# Altium schematic sheet Sensor_LoRa_Moist.SchDoc: Title
size 420 x 297 mm; Author: G.Kasprowicz; CompanyName: WUT ISE; DrawnBy: G.Kasprowicz; Organization: WUT ISE; Address1: PW ISE; Address2: Nowowiejska 15/19 00-665 Warsaw; Address3: gkasprow@gmail.com; Revision: 1.0; SheetNumber: -; SheetTotal: -; ModifiedBy: -; CheckedDate: -; Title2: Title2; DivGrp: WUT ISE; Designer: G.Kasprowicz; ModifiedDate: -; ProjectName: Sensor Box
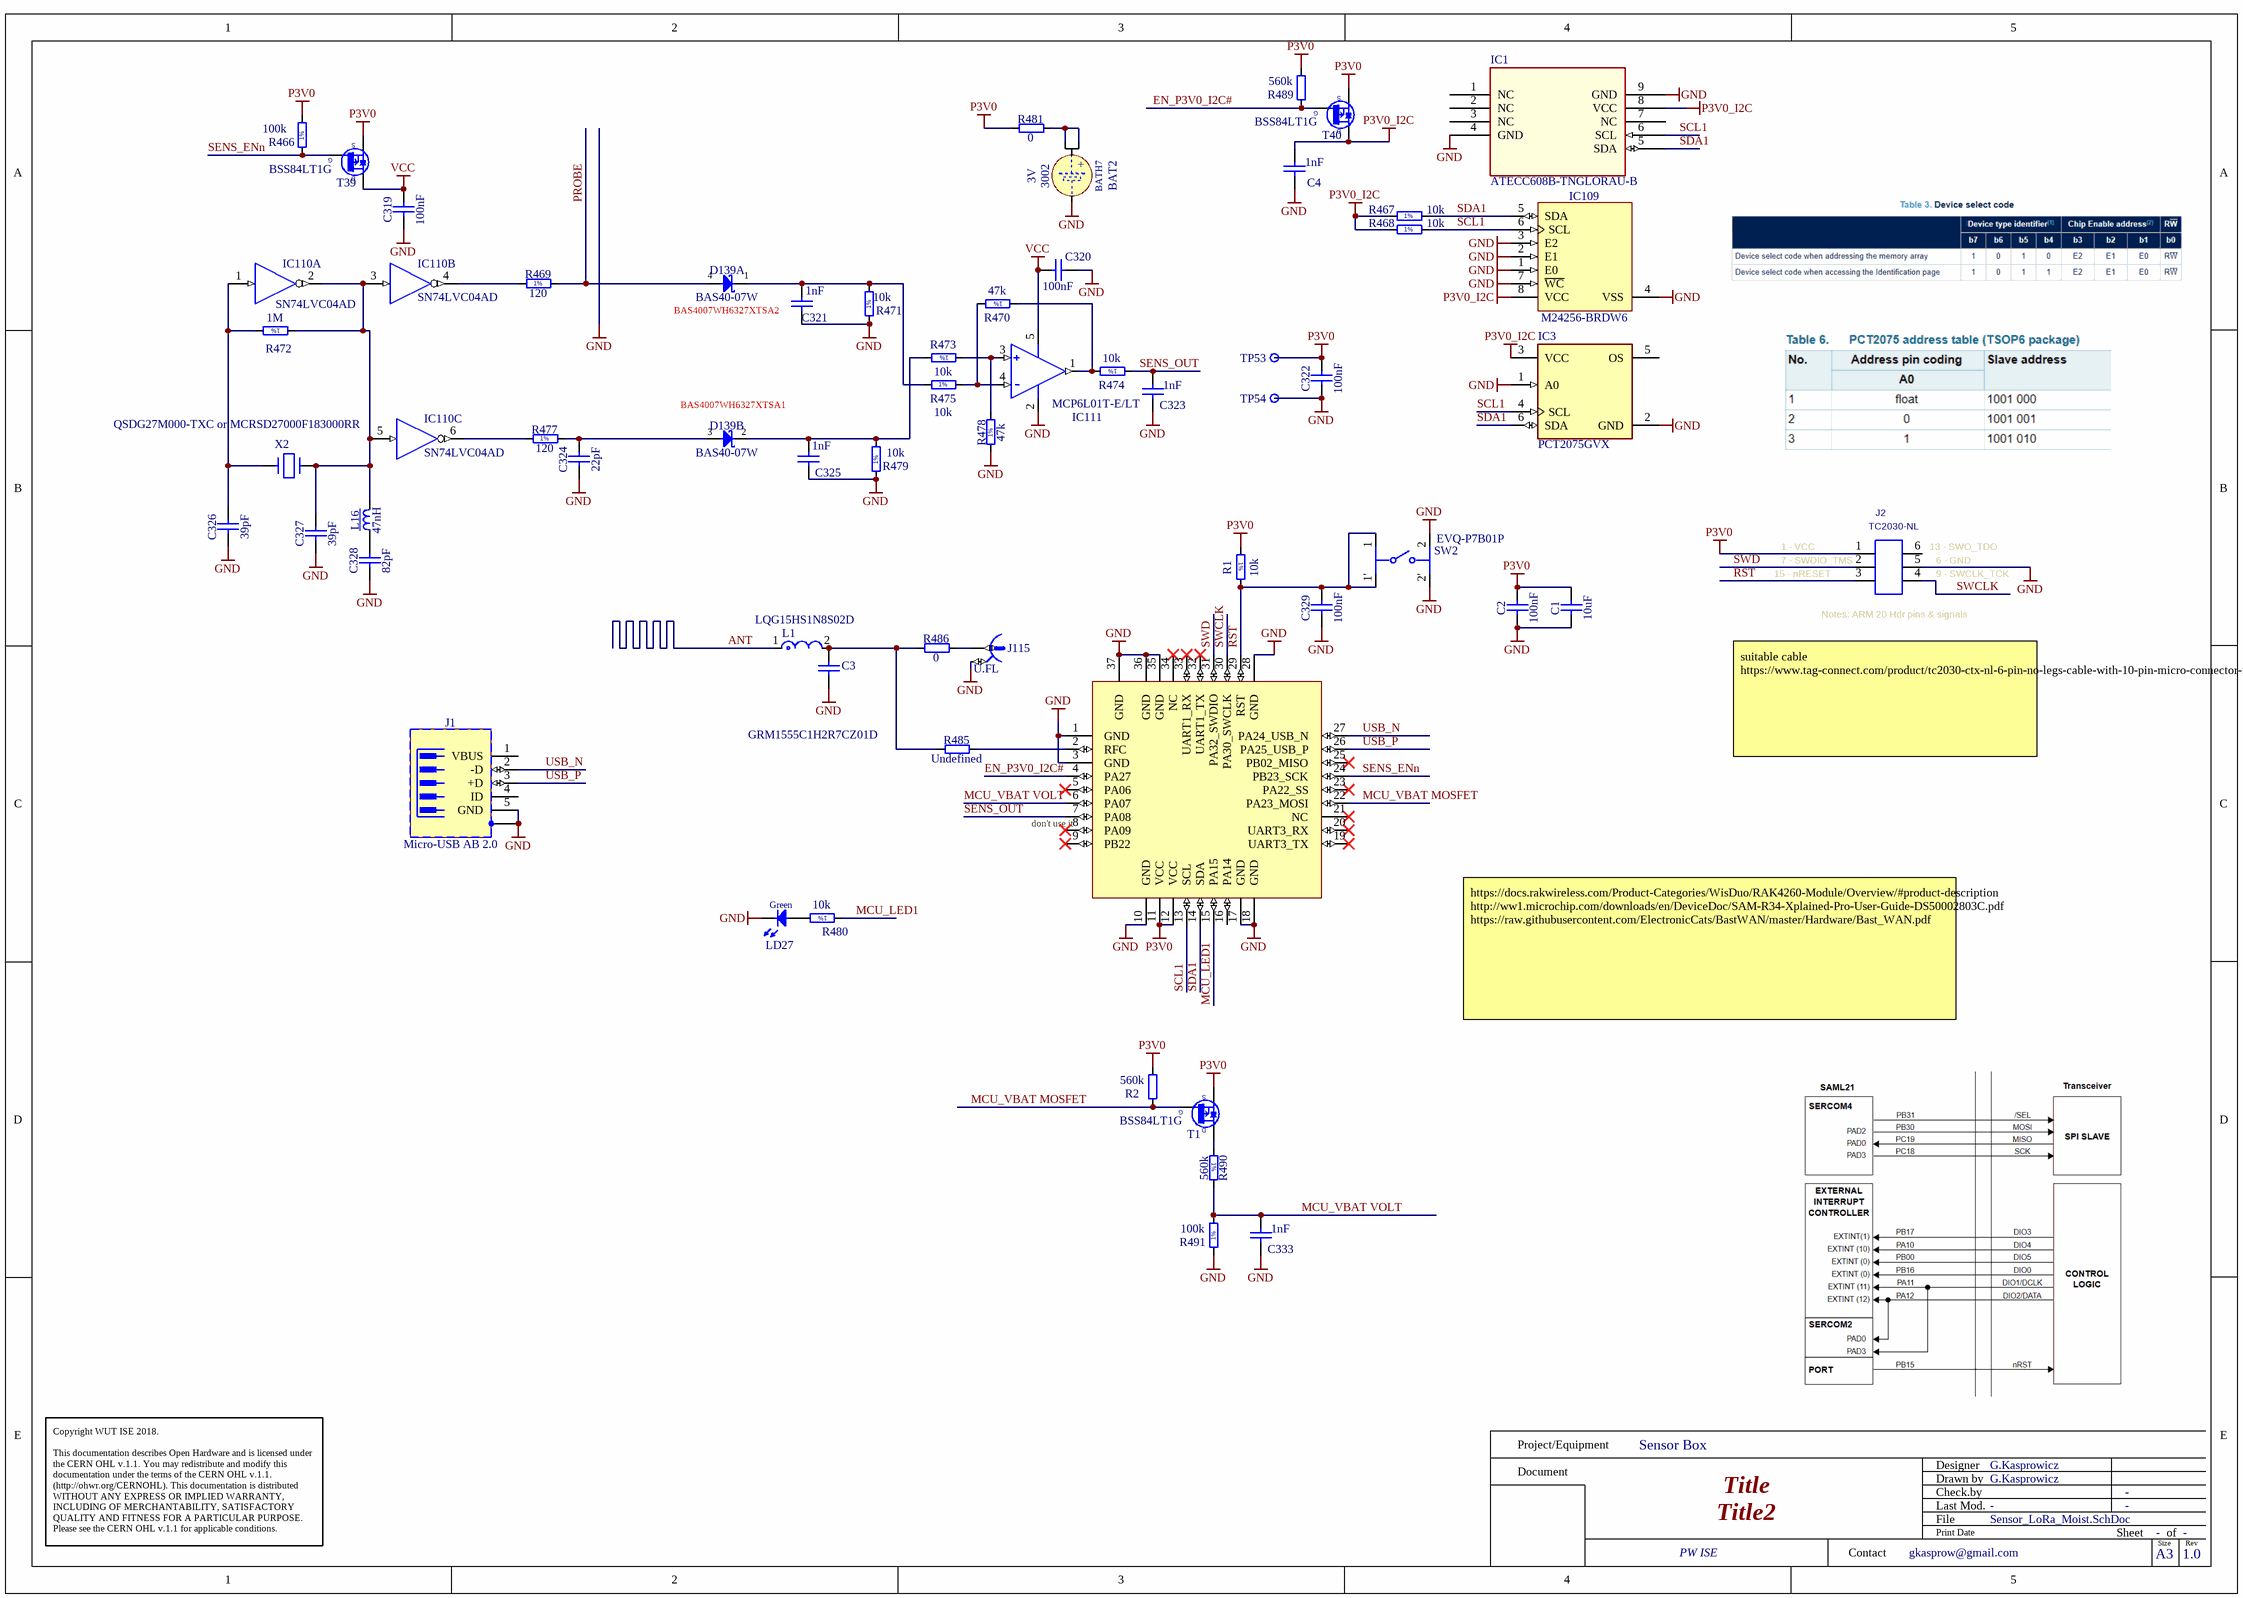
[diagram p0: Sensor_LoRa_Moist.SchDoc]

## Parts
BAT2  3V  [BAT_VARTA_CR2032]
BATH7  3002  [KEYSTONE 3002]
C1  10uF  [CAPC2012X135N]
C2  100nF  [CAPC1005X55N]
C3  GRM1555C1H2R7CZ01D  [CAPC1005X55X25ML05T10]
C4  1nF  [CAPC1005X55N]
C319  100nF  [CAPC1005X55N]
C320  100nF  [CAPC1005X55N]
C321  1nF  [CAPC1005X55N]
C322  100nF  [CAPC1005X55N]
C323  1nF  [CAPC1005X55N]
C324  22pF  [CAPC1005X55N]
C325  1nF  [CAPC1005X55N]
C326  39pF  [CAPC1608X87N]
C327  39pF  [CAPC1608X87N]
C328  82pF  [CAPC2012X90N]
C329  100nF  [CAPC1005X55N]
C333  1nF  [CAPC1005X55N]
D139  BAS40-07W  [INFINEON-PG-SOT343-4]  (parts A,B of 2)
IC1  ATECC608B-TNGLORAU-B  [UDFN8_MUY/Q4B_MCH-L]
IC2  RAK4260 - EU868  [RAK4260]  (value not drawn)
IC3  PCT2075GVX  [FP-SOT1353-1-MFG]
IC109  M24256-BRDW6  [SOP65P640X120-8N]
IC110  SN74LVC04AD  [SOIC127P600X175-14N]  (parts A,B,C of 6)
IC111  MCP6L01T-E/LT  [SC70]
J1  Micro-USB AB 2.0  [HIROSE_ZX62RD-AB-5P8]
J2  TC2030-NL  [TC2030-IDC]  (no BOM)
J115  U.FL  [HIROSE_U.FL-R-SMT-1(10)]
L1  LQG15HS1N8S02D  [FP-LQG15HH_02-IPC_C]
L16  47nH  [IND_COILCRAFT_0805CS]
LD27  Green  [LED_KINGBRIGHT_KPH-1608CGCK]
R1  10k  [RESC1005X40N]
R2  560k  [RESC1005X40N]
R466  100k  [RESC1005X40N]
R467  10k  [RESC1005X40N]
R468  10k  [RESC1005X40N]
R469  120  [RESC1005X40N]
R470  47k  [RESC1005X40N]
R471  10k  [RESC1005X40N]
R472  1M  [RESC1005X40N]
R473  10k  [RESC1005X40N]
R474  10k  [RESC1005X40N]
R475  10k  [RESC1005X40N]
R477  120  [RESC1005X40N]
R478  47k  [RESC1005X40N]
R479  10k  [RESC1005X40N]
R480  10k  [RESC1005X40N]
R481  0  [RESC1608X55N]
R485  Undefined  [RESC1608X55N]
R486  0  [RESC1608X55N]
R489  560k  [RESC1005X40N]
R490  560k  [RESC1005X40N]
R491  100k  [RESC1005X40N]
SW2  EVQ-P7B01P  [FP-EVQ-P7B01P-MFG]
T1  BSS84LT1G  [SOT95P240X110-3N]
T39  BSS84LT1G  [SOT95P240X110-3N]
T40  BSS84LT1G  [SOT95P240X110-3N]
TP53  Test Point  [TPS127]  (value not drawn)
TP54  Test Point  [TPS127]  (value not drawn)
X2  QSDG27M000-TXC or MCRSD27000F183000RR  [HC-49SM]

## Nets
GND: BATH7.2(MINUS) C1.1 C2.1 C3.1 C4.1 C319.1 C320.2 C321.1 C322.1 C323.1 C324.1 C325.1 C326.1 C327.1 C328.1 C329.1 C333.1 IC1.4(GND) IC1.9(GND) IC2.1(GND) IC2.3(GND) IC2.10(GND) IC2.17(GND) IC2.18(GND) IC2.28(GND) IC2.35(GND) IC2.36(GND) IC2.37(GND) IC3.1(A0) IC3.2(GND) IC109.1(E0) IC109.2(E1) IC109.3(E2) IC109.4(VSS) IC109.7(~{WC}) IC110.7(GND) IC111.2(V-) J1.5(GND) J1.6(SH) J2.5 J115.2 LD27.1(C) R471.1 R478.1 R479.1 R491.1 SW2.2 SW2.2' TP54.1
P3V0: C1.2 C2.2 C322.2 IC2.11(VCC) IC2.12(VCC) J2.1 R1.1 R2.2 R466.2 R481.1 R489.2 T1.2(S) T39.2(S) T40.2(S) TP53.1
P3V0_I2C: C4.2 IC1.8(VCC) IC3.3(VCC) IC109.8(VCC) R467.1 R468.1 T40.3(D)
VCC: C319.2 C320.1 IC110.14(VCC) IC111.5(V+) T39.3(D)
ANT: L1.1
EN_P3V0_I2C#: IC2.4(PA27) R489.1 T40.1(G)
MCU_LED1: IC2.15(PA15) R480.1
MCU_VBAT MOSFET: IC2.22(PA23_MOSI) R2.1 T1.1(G)
MCU_VBAT VOLT: C333.2 IC2.6(PA07) R490.2 R491.2
PROBE: D139.4(A) R469.2
RST: C329.2 IC2.29(RST) J2.3 R1.2 SW2.1 SW2.1'
SCL1: IC1.6(SCL) IC2.13(SCL) IC3.4(SCL) IC109.6(SCL) R468.2
SDA1: IC1.5(SDA) IC2.14(SDA) IC3.6(SDA) IC109.5(SDA) R467.2
SENS_ENn: IC2.24(PB23_SCK) R466.1 T39.1(G)
SENS_OUT: C323.2 IC2.7(PA08) R474.1
SWCLK: IC2.30(PA30_SWCLK) J2.4
SWD: IC2.31(PA32_SWDIO) J2.2
USB_N: IC2.27(PA24_USB_N) J1.2(-D)
USB_P: IC2.26(PA25_USB_P) J1.3(+D)
NetBATH7_1a: BATH7.1a(PLUS) BATH7.1b(PLUS) R481.2
NetC3_2: C3.2 L1.2 R485.2 R486.2
NetC321_2: C321.2 D139.1(C) R471.2 R475.1
NetC324_2: C324.2 D139.3(C) R477.2
NetC325_2: C325.2 D139.2(A) R473.2 R479.2
NetC326_2: C326.2 IC110.1(A) R472.2 X2.1
NetC327_2: C327.2 IC110.2(~{O}) IC110.3(A) IC110.5(A) L16.2 R472.1 X2.2
NetC328_2: C328.2 L16.1
NetIC2_2: IC2.2(RFC) R485.1
NetIC110_4: IC110.4(~{O}) R469.1
NetIC110_6: IC110.6(~{O}) R477.1
NetIC111_1: IC111.1(OUT) R470.1 R474.2
NetIC111_3: IC111.3(IN+) R473.1 R478.2
NetIC111_4: IC111.4(in-) R470.2 R475.2
NetJ115_1: J115.1 R486.1
NetLD27_2: LD27.2(A) R480.2
NetR490_1: R490.1 T1.3(D)

Not connected (* = marked no-connect by the designer): IC1 1(NC) 2(NC) 3(NC) 7(NC); IC2 5(PA06)* 8(PA09)* 9(PB22)* 16(PA14) 19(UART3_TX)* 20(UART3_RX)* 21(NC)* 23(PA22_SS)* 25(PB02_MISO)* 32(UART1_TX)* 33(UART1_RX)* 34(NC)*; IC3 5(OS); J1 1(VBUS) 4(ID); J2 6

## Notes on the sheet
- (near D139) BAS4007WH6327XTSA2
- (near D139) BAS4007WH6327XTSA1
- suitable cable
  https://www.tag-connect.com/product/tc2030-ctx-nl-6-pin-no-legs-cable-with-10-pin-micro-connector-for-cortex-processors
- (near IC2) don't use it
- https://docs.rakwireless.com/Product-Categories/WisDuo/RAK4260-Module/Overview/#product-description
  http://ww1.microchip.com/downloads/en/DeviceDoc/SAM-R34-Xplained-Pro-User-Guide-DS50002803C.pdf
  https://raw.githubusercontent.com/ElectronicCats/BastWAN/master/Hardware/Bast_WAN.pdf
- Project/Equipment
- Document
- Designer
- Drawn by
- Check.by
- Copyright WUT ISE 2018.
  This documentation describes Open Hardware and is licensed under the CERN OHL v.1.1. You may redistribute and modify this documentation under the terms of the CERN OHL v.1.1. (http://ohwr.org/CERNOHL). This documentation is distributed WITHOUT ANY EXPRESS OR IMPLIED WARRANTY, INCLUDING OF MERCHANTABILITY, SATISFACTORY QUALITY AND FITNESS FOR A PARTICULAR PURPOSE. Please see the CERN OHL v.1.1 for applicable conditions.
- Contact
- File
- Last Mod.
- Print Date
- Sheet
- Size
- A3
- of
- Rev
- (in symbol BAT_VARTA_CR2032) +
- (in symbol BATTERY_HOLD_CR2032_SMD) +
- (in symbol HDR 6 TC2030-NL) 1 - VCC; 13 - SWO_TDO; 7 - SWDIO_TMS; 6 - GND; 15 - nRESET; 9 - SWCLK_TCK; Notes: ARM 20 Hdr pins & signals
- (in symbol R0402_1M_1%_0.0625W_100PPM) 1%
- (in symbol R0402_10K_1%_0.0625W_100PPM) 1%
- (in symbol R0402_47K_1%_0.0625W_100PPM) 1%
- (in symbol R0402_100K_1%_0.0625W_100PPM) 1%
- (in symbol R0402_120R_1%_0.0625W_100PPM) 1%
- (in symbol R0402_560K_1%_0.0625W_100PPM) 1%

## Library data of the parts
BAT2 = BAT_VARTA_CR2032: Battery for use only with Socket Holder; Part Description: 20x3.2mm Lithium Coin Cells Type CR2032; Manufacturer: VARTA; Manufacturer Part Number: 6032101501; PressFit: No; Power: 230mAh; Part Number: BAT_VARTA_CR2032; Component Kind: Standard; Component Type: Standard; Pin Count: 0; PackageDescription: CR2032, 20mm Diameter x 3.2mm  Height Lithium Coin Cells; Family: Battery; Mounted: Yes; Socket: Yes; SMD: No; Sense: No; Value: 3V; ComponentHeight: 3.2mm; HelpURL: \\cern.ch\dfs\Applications\Altium\Datasheets\BAT_VARTA_CR2032.pdf; Author: CERN DEM JLC; CreateDate: 20/10/2009; LatestRevisionDate: 20/10/2009
BATH7 = BATTERY_HOLD_CR2032_SMD: Battery Holder Keystone 3002; Part Number: BATH_KEYSTONE_3000; Part Description: KEYSTONE 3002 CR2032 BATTERY HOLDER; PressFit: No; Component Kind: Standard; Component Type: Standard; Pin Count: 3; PackageDescription: KEYSTONE 3002 CR2032 BATTERY HOLDER; Family: Battery; Mounted: Yes; Socket: No; SMD: Yes; Sense: No; Manufacturer: KEYSTONE; Manufacturer Part Number: 3002; ComponentHeight: 3.17mm; HelpURL: \\cern.ch\dfs\Applications\Altium\Datasheets\BATH_KEYSTONE_3000.pdf; Author: GK; CreateDate: 17/04/2012; LatestRevisionDate: 07/06/2017
C1 = CC0805_10UF_16V_10%_X5R: Non-polarised capacitor; Part Description: SMD Multilayer Chip Ceramic Capacitor; Manufacturer: GENERIC; Manufacturer1 Part Number: C0805C106K4PAC; Voltage: 16V; TC: X5R; Tolerance: ±10%; Part Number: CC0805_10UF_16V_10%_X5R; Component Kind: Standard; Component Type: Standard; Pin Count: 2; Value: 10uF; Status: Preferred; Manufacturer Part Number: CC0805_10UF_16V_10%_X5R; Case: 0805; Mounted: Yes; Socket: No; SMD: Yes; Sense: No; Manufacturer1 Example: KEMET; Manufacturer1 ComponentHeight: 1.4mm; HelpURL: \\cern.ch\dfs\Applications\Altium\Datasheets\CC1206_X5R_KEMET.pdf; Author: CERN DEM JLC; CreateDate: 03.12.2007; LatestRevisionDate: 03.12.2007
C2 C319 C320 C322 C329 = CC0402_100NF_16V_10%_X5R: Non-polarised capacitor; Part Description: SMD Multilayer Chip Ceramic Capacitor; Manufacturer: GENERIC; Manufacturer1 Part Number: GRM155R61C104KA88D; Voltage: 16V; TC: X5R; Tolerance: ±10%; Part Number: CC0402_100NF_16V_10%_X5R; Component Kind: Standard; Component Type: Standard; Pin Count: 2; Value: 100nF; Status: None; Manufacturer Part Number: CC0402_100NF_16V_10%_X5R; Case: 0402; Mounted: Yes; Socket: No; SMD: Yes; Sense: No; Manufacturer1 Example: MURATA; Manufacturer1 ComponentHeight: 0.55mm; HelpURL: \\cern.ch\dfs\Applications\Altium\Datasheets\CC0402_X5R_MURATA_GRM.pdf; Author: CERN DEM JLC; CreateDate: 10.12.2013; LatestRevisionDate: 10.12.2013
C3 = CMP-2008-04329-1: Manufacturer: Murata; Part Number: GRM1555C1H2R7CZ01D
C4 C321 C323 C325 C333 = CC0402_1NF_50V_10%_X7R: Non-polarised capacitor; Part Description: SMD Multilayer Chip Ceramic Capacitor; Manufacturer: GENERIC; Manufacturer1 Part Number: 223858715623; Voltage: 50V; TC: X7R; Tolerance: ±10%; Part Number: CC0402_1NF_50V_10%_X7R; Component Kind: Standard; Component Type: Standard; Pin Count: 2; Value: 1nF; Status: Not Recommended; Manufacturer Part Number: CC0402_1NF_50V_10%_X7R; Case: 0402; Mounted: Yes; Socket: No; SMD: Yes; Sense: No; Manufacturer1 Example: PHYCOMP; Manufacturer1 ComponentHeight: 0.55mm; HelpURL: \\cern.ch\dfs\Applications\Altium\Datasheets\CC0402_X7R_PHYCOMP.pdf; Author: CERN DEM JLC; CreateDate: 03/12/2007; LatestRevisionDate: 03/12/2007
C324 = CC0402_22PF_50V_5%_C0G: Non-polarised capacitor; Part Description: SMD Multilayer Chip Ceramic Capacitor; Manufacturer: GENERIC; Manufacturer1 Part Number: C0402C220J5GACTU; Voltage: 50V; TC: C0G/NP0; Tolerance: ±5%; Part Number: CC0402_22PF_50V_5%_C0G; Component Kind: Standard; Component Type: Standard; Pin Count: 2; Value: 22pF; Status: Preferred; Manufacturer Part Number: CC0402_22PF_50V_5%_C0G; Case: 0402; Mounted: Yes; Socket: No; SMD: Yes; Sense: No; Manufacturer1 Example: KEMET; Manufacturer1 ComponentHeight: 0.55mm; HelpURL: \\cern.ch\dfs\Applications\Altium\Datasheets\CC0805_C0G_KEMET_(Commercial Grade).pdf; Author: CERN DEM JLC; CreateDate: 03/12/2007; LatestRevisionDate: 03/12/2007
C326 C327 = CC0603_39PF_50V_5%_NP0: Non-polarised capacitor; Part Description: SMD Multilayer Chip Ceramic Capacitor; Manufacturer: GENERIC; Manufacturer1 Part Number: 223886715399; Voltage: 50V; TC: C0G/NP0; Tolerance: ±5%; Part Number: CC0603_39PF_50V_5%_NP0; Component Kind: Standard; Component Type: Standard; Pin Count: 2; Value: 39pF; Status: Preferred; Manufacturer Part Number: CC0603_39PF_50V_5%_NP0; Case: 0603; Mounted: Yes; Socket: No; SMD: Yes; Sense: No; Manufacturer1 Example: PHYCOMP; Manufacturer1 ComponentHeight: 0.87mm; HelpURL: \\cern.ch\dfs\Applications\Altium\Datasheets\CC0603_NP0_PHYCOMP.pdf; Author: CERN DEM JLC; CreateDate: 03/12/2007; LatestRevisionDate: 03/12/2007
C328 = CC0805_82PF_100V_1%_NP0_AVX_08051A820FAT2A: Non-polarised capacitor; Part Description: SMD Multilayer Chip Ceramic Capacitor; Manufacturer: AVX; Voltage: 100V; TC: NP0; Tolerance: ±1%; Part Number: CC0805_82PF_100V_1%_NP0_AVX_08051A820FAT2A; Component Kind: Standard; Component Type: Standard; Pin Count: 2; Value: 82pF; Status: Not Recommended; Manufacturer Part Number: 08051A820FAT2A; Case: 0805; Mounted: Yes; Socket: No; SMD: Yes; Sense: No; ComponentHeight: 0.9mm; HelpURL: \\cern.ch\dfs\Applications\Altium\Datasheets\CC0805_C0G_AVX.pdf; Author: CERN DEM WB; CreateDate: 26/07/2016; LatestRevisionDate: 26/07/2016
D139 = D_BAS40-07W: Anti-Parallel Pair Schottky Diode; Part Number: BAS4007WH6327XTSA1; Part Description: independent Pair Schottky Diode; Manufacturer: INFINEON; Voltage: 4V; Power: 120mA; PressFit: No; Bonding: No; Component Kind: Standard; Component Type: Standard; Device: BAS40-07W; PackageDescription: INFINEON PG-SOT343-4, SOT343, 1.30mm Pitch; 4 Pin,1.25mm W X 2.00mm L X 1.10mm H body, IPC Medium Density; Manufacturer Part Number: BAS4007WH6327XTSA1; Pin Count: 4; Case: SOT343; Mounted: Yes; Socket: No; SMD: Yes; Sense: No; ComponentHeight: 1.1mm; HelpURL: \\cern.ch\dfs\Applications\Altium\Datasheets\BAT15099E6327HTSA1.pdf; Author: GK; CreateDate: 28/03/2018; LatestRevisionDate: 28/03/2018
IC1 = CRYPTO_ATECC608B-TNGLORAU-B: Pre-provisioned secure element for LoRaWAN; Vendor: Microchip; Built_By: EMA_Cory; SourceLibrary: Add_to_database_2021-02-23; Datasheet: https://ww1.microchip.com/downloads/en/DeviceDoc/ATECC608B-TNGLoRaWAN-CryptoAuthentication-Data-Sheet-DS40002248A.pdf; Manufacturer_Part_Number: ATECC608B-TNGLORAU-B; Copyright: Copyright (C) 2018 Accelerated Designs. All rights reserved; RefDes: RefDes; Type: DEV
IC2 = RF_RAK4260: RAK4260 LoRaWAN module from RAKwireless.; Manufacturer Part Number: RAK4260 - EU868; Manufacturer: RAK WIreless; DeviceName: RAK4260 - EU868; Device: RAK4260 - EU868; Part Description: RAK4260 LoRaWAN module; Package: RAK4260
IC3 = CMP-10174-000001-1: SENSOR DIGITAL -55C-125C 6TSOP; Manufacturer: NXP Semiconductors; Max Supply Voltage: 5.5V; Min Supply Voltage: 2.7V; Sensor Output: I2C; Resolution: 11bits; Standoff Height: 0.013mm; Operating Supply Current: 125-200uA; Max Junction Temp: +150°C; Digikey Description: SENSOR DIGITAL -55C-125C 6TSOP; ComponentLink2Description: Datasheet; Ambient Temperature Range High: +125°C; Mouser Description: Board Mount Temperature Sensors Digital temp sensor and thermal watchdog; Ipc Land Pattern Name: SOT95P275X100-6; RoHS: TRUE; Interface: I2C; Device Class L3: unset; Footprint Url: https://www.nxp.com/docs/en/package-information/SOT1353-1.pdf; Device Class L1: Sensors; Manufacturer Part Number: PCT2075GVX; Temperature: -55°C to +125°C; Lead Free: Yes; ComponentLink2URL: https://www.nxp.com/docs/en/data-sheet/PCT2075.pdf; Height: 1.1mm; Device Class L2: Temperature and Humidity Sensors; Temperature Range High: +125°C; Package: SOT1353-1; Category: IC; Automotive: No; Ambient Temperature Range Low: -55°C; Temperature Range Low: -55°C; Octopart: https://octopart.com/pct2075gvx-nxp+semiconductors-50417606
IC109 = MEM_M24256-BRDW6P: 256-Kbit Serial I²C Bus EEPROM; Manufacturer: ST MICROELECTRONICS; PressFit: No; Bonding: No; Part Number: M24256-BRDW6P; Component Kind: Standard; Component Type: Standard; Device: M24256-BRDW6; PackageDescription: SOP, 0.65mm pitch; 8 pin, 4.40mm W X 3.00mm L X 1.20mm H body, IPC Medium Density; Part Description: 256-Kbit Serial I²C Bus EEPROM; Manufacturer Part Number: M24256-BRDW6; Pin Count: 8; Case: TSSOP8; Mounted: Yes; Socket: No; SMD: Yes; Sense: No; ComponentHeight: 1.2mm; HelpURL: \\cern.ch\dfs\Applications\Altium\Datasheets\M24256-BRDW6P.pdf; Author: CERN DEM MR; CreateDate: 17.03.2016; LatestRevisionDate: 17.03.2016
IC110 = SN74LVC04AD: Hex Inverter; Part Description: Hex Inverters; Manufacturer: TEXAS INSTRUMENTS; PressFit: No; Bonding: No; Part Number: SN74LVC04AD; Component Kind: Standard; Component Type: Standard; Device: SN74LVC04AD; PackageDescription: SOIC 14, Pitch 1.27mm - Body 4x8.75mm, IPC Medium Density; Manufacturer Part Number: SN74LVC04AD; Pin Count: 12; Case: SOIC14; Mounted: Yes; Socket: No; SMD: Yes; Sense: No; ComponentHeight: 1.75mm; Author: CERN DEM JLC; HelpURL: \\cern.ch\dfs\Applications\Altium\Datasheets\SN74LVC04AD.pdf; CreateDate: 21/06/2011; LatestRevisionDate: 21/06/2011
IC111 = OA_MCP6001_SC-70: 1 MHz, Low-Power Op Amp
J1 = HIROSE_ZX62RD-AB-5P8: 5 Pin + 1 Shield USB Receptacle; Part Description: Micro-USB 2.0 Right Angle, SMD Type AB - Reverse (Top mount), Shell Through Hole; Manufacturer: HIROSE (HRS); PressFit: No; Part Number: HIROSE_ZX62RD-AB-5P8; Component Kind: Standard; Component Type: Standard; Pin Count: 7; Family: Micro-USB AB 2.0; Mounted: Yes; Socket: No; SMD: Yes; Sense: No; Status: Obsolete; Manufacturer Part Number: ZX62RD-AB-5P8; ComponentHeight: 2.35mm; HelpURL: \\cern.ch\dfs\Applications\Altium\Datasheets\HIROSE_ZX62RD-AB-5P8.pdf; ComponentLink1URL: \\cern.ch\dfs\Applications\Altium\Datasheets\HIROSE_ZX62RD-AB-5P8_Package-Drawing.pdf; ComponentLink1Description: Package-Drawing; Author: CERN DEM JLC; CreateDate: 29.10.2014; LatestRevisionDate: 22.06.2017
J2 = HDR 6 TC2030-NL: HDR, TC2030, 6 Pin, Footprint only; Mfg-1: Tag-Connect; Mfg-1-P/N: TC2030-IDC-NL; Value: TC2030-NL
J115 = HIROSE_U.FL-R-SMT-1(10): Part Description: Up to 6GHz Ultra Small Surface Mount Male Coaxial Connectors U.FL Series; Manufacturer: HIROSE (HRS); PressFit: No; Part Number: HIROSE_U.FL-R-SMT-1(10); Component Kind: Standard; Component Type: Standard; Pin Count: 2; Family: U.FL; Mounted: Yes; Socket: No; SMD: Yes; Sense: No; Status: None; Manufacturer Part Number: U.FL-R-SMT-1(10); ComponentHeight: 1.25mm; HelpURL: \\cern.ch\dfs\Applications\Altium\Datasheets\HIROSE_U.FL-R-SMT-1(10).pdf; Author: CERN DEM JLC; CreateDate: 24/03/2010; LatestRevisionDate: 24/03/2010
L1 = CMP-06042-005877-1: Multilayer type RF Inductor 1.8nH ±0.3nH 0.08Ω 950mA 0402; Self Resonant Frequency: 6GHz; Core Material: Air; DC Current: 300mA; Q Factor: 8; Test Frequency: 100MHz; Shielding: Unshielded; DC Resistance (DCR): 100mR; Inductance: 1.8nH; Packaging: Tape and Reel; Lead Free: Lead Free; Min Operating Temperature: -55°C; Height - Seated (Max): 0.022inch; Case/Package: 0402; Mount: Surface Mount; Package Quantity: 1; Width: 0.02inch; Length: 0.039inch; Max Operating Temperature: 125°C; Depth: 0.55mm; Height: 0.5mm; Radiation Hardening: No; Max DC Current: 300mA; Case Code (Metric): 1005; Termination: SMD/SMT; Military Standard: Not; Current Rating: 300mA; Case Code (Imperial): 0402
L16 = IND_47NH_2%_COILCRAFT_0805CS: Inductor With Core; Part Description: SMT Chip Inductor; Manufacturer Part Number: 0805CS-470XGLC; Power: 500mA; Resistance: 0.31R; Tolerance: ±2%; Part Number: IND_47NH_2%_COILCRAFT_0805CS; Component Kind: Standard; Component Type: Standard; Pin Count: 2; Value: 47nH; Status: None; Manufacturer: COILCRAFT; Case: 0805; Mounted: Yes; Socket: No; SMD: Yes; Sense: No; ComponentHeight: 1.52mm; HelpURL: \\cern.ch\dfs\Applications\Altium\Datasheets\IND_COILCRAFT_0805CS.pdf; Author: CERN DEM JLC; CreateDate: 19/08/2013; LatestRevisionDate: 20/08/2013
LD27 = LED_KINGBRIGHT_KPH-1608CGCK: LED Green 1C 2A; Part Description: SMD Green LED, Case 1.6mmX0.8mm(0603), 0.65mm Thickness; PressFit: No; Bonding: No; Part Number: LED_KINGBRIGHT_KPH-1608CGCK; Component Kind: Standard; Component Type: Standard; Color: Green; PackageDescription: SMT Green LED, Case 0603, Body L 1.6 x W 0.8mm H 0.65mm; Manufacturer: KINGBRIGHT; Manufacturer Part Number: KPH-1608CGCK; Pin Count: 2; Mounted: Yes; Socket: No; SMD: Yes; Sense: No; ComponentHeight: 0.65mm; HelpURL: \\cern.ch\dfs\Applications\Altium\Datasheets\LED_KINGBRIGHT_KPH-1608CGCK.pdf; Author: CERN DEM JLC; CreateDate: 03.07.2017; LatestRevisionDate: 03.07.2017
R1 R467 R468 R471 R473-R475 R479 R480 = R0402_10K_1%_0.0625W_100PPM: Resistor - 1%; Part Description: General Purpose Thick Film Chip Resistor; Manufacturer: GENERIC; Manufacturer1 Part Number: 232270671003L; TC: ±100ppm/°C; PressFit: No; Part Number: R0402_10K_1%_0.0625W_100PPM; Component Kind: Standard; Component Type: Standard; Pin Count: 2; Value: 10k; Status: Not Recommended; Power: 0.0625W; Tolerance: ±1%; Manufacturer Part Number: R0402_10K_1%_0.0625W_100PPM; Case: 0402; Mounted: Yes; Sense: No; Socket: No; SMD: Yes; Manufacturer1 Example: YAGEO PHYCOMP; Manufacturer1 ComponentHeight: 0.4mm; HelpURL: \\cern.ch\dfs\Applications\Altium\Datasheets\R0402_Phycomp_RC0402.pdf; Author: CERN DEM JLC; CreateDate: 03.12.2007; LatestRevisionDate: 17.10.2012
R2 R489 R490 = R0402_560K_1%_0.0625W_100PPM: Resistor - 1%; Part Description: General Purpose Thick Film Chip Resistor; Manufacturer: GENERIC; Manufacturer1 Part Number: 232270675604L; TC: ±100ppm/°C; PressFit: No; Part Number: R0402_560K_1%_0.0625W_100PPM; Component Kind: Standard; Component Type: Standard; Pin Count: 2; Value: 560k; Status: Not Recommended; Power: 0.0625W; Tolerance: ±1%; Manufacturer Part Number: R0402_560K_1%_0.0625W_100PPM; Case: 0402; Mounted: Yes; Sense: No; Socket: No; SMD: Yes; Manufacturer1 Example: YAGEO PHYCOMP; Manufacturer1 ComponentHeight: 0.4mm; HelpURL: \\cern.ch\dfs\Applications\Altium\Datasheets\R0402_Phycomp_RC0402.pdf; Author: CERN DEM JLC
  R2 R489: CreateDate: 03.12.2007; LatestRevisionDate: 17.10.2012
  R490: CreateDate: 03/12/2007; LatestRevisionDate: 17/10/2012
R466 R491 = R0402_100K_1%_0.0625W_100PPM: Resistor - 1%; Part Description: General Purpose Thick Film Chip Resistor; Manufacturer: GENERIC; Manufacturer1 Part Number: 232270671004L; TC: ±100ppm/°C; PressFit: No; Part Number: R0402_100K_1%_0.0625W_100PPM; Component Kind: Standard; Component Type: Standard; Pin Count: 2; Value: 100k; Status: Not Recommended; Power: 0.0625W; Tolerance: ±1%; Manufacturer Part Number: R0402_100K_1%_0.0625W_100PPM; Case: 0402; Mounted: Yes; Sense: No; Socket: No; SMD: Yes; Manufacturer1 Example: YAGEO PHYCOMP; Manufacturer1 ComponentHeight: 0.4mm; HelpURL: \\cern.ch\dfs\Applications\Altium\Datasheets\R0402_Phycomp_RC0402.pdf; Author: CERN DEM JLC; CreateDate: 03/12/2007; LatestRevisionDate: 17/10/2012
R469 R477 = R0402_120R_1%_0.0625W_100PPM: Resistor - 1%; Part Description: General Purpose Thick Film Chip Resistor; Manufacturer: GENERIC; Manufacturer1 Part Number: 232270671201L; TC: ±100ppm/°C; PressFit: No; Part Number: R0402_120R_1%_0.0625W_100PPM; Component Kind: Standard; Component Type: Standard; Pin Count: 2; Value: 120; Status: Not Recommended; Power: 0.0625W; Tolerance: ±1%; Manufacturer Part Number: R0402_120R_1%_0.0625W_100PPM; Case: 0402; Mounted: Yes; Sense: No; Socket: No; SMD: Yes; Manufacturer1 Example: YAGEO PHYCOMP; Manufacturer1 ComponentHeight: 0.4mm; HelpURL: \\cern.ch\dfs\Applications\Altium\Datasheets\R0402_Phycomp_RC0402.pdf; Author: CERN DEM JLC; CreateDate: 03/12/2007; LatestRevisionDate: 17/10/2012
R470 R478 = R0402_47K_1%_0.0625W_100PPM: Resistor - 1%; Part Description: General Purpose Thick Film Chip Resistor; Manufacturer: GENERIC; Manufacturer1 Part Number: 232270675103L; TC: ±100ppm/°C; PressFit: No; Part Number: R0402_47K_1%_0.0625W_100PPM; Component Kind: Standard; Component Type: Standard; Pin Count: 2; Value: 47k; Status: Not Recommended; Power: 0.0625W; Tolerance: ±1%; Manufacturer Part Number: R0402_47K_1%_0.0625W_100PPM; Case: 0402; Mounted: Yes; Sense: No; Socket: No; SMD: Yes; Manufacturer1 Example: YAGEO PHYCOMP; Manufacturer1 ComponentHeight: 0.4mm; HelpURL: \\cern.ch\dfs\Applications\Altium\Datasheets\R0402_Phycomp_RC0402.pdf; Author: CERN DEM JLC; CreateDate: 03/12/2007; LatestRevisionDate: 17/10/2012
R472 = R0402_1M_1%_0.0625W_100PPM: Resistor - 1%; Part Description: General Purpose Thick Film Chip Resistor; Manufacturer: GENERIC; Manufacturer1 Part Number: 232270671005L; TC: ±100ppm/°C; PressFit: No; Part Number: R0402_1M_1%_0.0625W_100PPM; Component Kind: Standard; Component Type: Standard; Pin Count: 2; Value: 1M; Status: Not Recommended; Power: 0.0625W; Tolerance: ±1%; Manufacturer Part Number: R0402_1M_1%_0.0625W_100PPM; Case: 0402; Mounted: Yes; Sense: No; Socket: No; SMD: Yes; Manufacturer1 Example: YAGEO PHYCOMP; Manufacturer1 ComponentHeight: 0.4mm; HelpURL: \\cern.ch\dfs\Applications\Altium\Datasheets\R0402_Phycomp_RC0402.pdf; Author: CERN DEM JLC; CreateDate: 03/12/2007; LatestRevisionDate: 17/10/2012
R481 R486 = R0603_0R_JUMPER: Resistor; Part Description: 1A (0.05R Max DC Resistance) Zero Ohm Jumper; Manufacturer: GENERIC; Manufacturer1 Part Number: NRC06Z0; PressFit: No; Part Number: R0603_0R_JUMPER; Component Kind: Standard; Component Type: Standard; Pin Count: 2; Value: 0; Status: Preferred; Manufacturer Part Number: R0603_0R_JUMPER; Case: 0603; Mounted: Yes; Sense: No; Socket: No; SMD: Yes; Manufacturer1 Example: NIC COMPONENT; Manufacturer1 ComponentHeight: 0.55mm; HelpURL: \\cern.ch\dfs\Applications\Altium\Datasheets\R0603_NIC_NRC.pdf; Author: CERN DEM JLC; CreateDate: 03/12/2007; LatestRevisionDate: 13/03/2008
R485 = R0603_NO-VALUE: Resistor; Part Description: Reserved Footprint For a 0603 (1608) Chip Resistor; PressFit: No; Mounted: No; Part Number: R0603_NO-VALUE; Component Kind: Standard; Component Type: Standard; Pin Count: 2; Value: Undefined; Status: None; Manufacturer: Undefined; Manufacturer Part Number: R0603_NO-VALUE; Case: 0603; Sense: No; Socket: No; SMD: Yes; Manufacturer1 Example: Undefined; Manufacturer1 Part Number: Undefined; Manufacturer1 ComponentHeight: Undefined; HelpURL: Undefined; Author: CERN DEM JLC; CreateDate: 03/12/2007; LatestRevisionDate: 13/03/2008
SW2 = CMP-05618-000129-1: SWITCH TACTILE SPST-NO 0.05A 12V; Switch Travel: 0.2mm; Illumination Type: Non-Illuminated; Switch Function: Off-Mom; Throw Configuration: SPST; Operating Force: 2.2N; Mechanical Life: 100000Cycles; Termination: J-Bend; Max Voltage Rating (DC): 12V; Mount: Surface Mount; Lead Free: Lead Free; Radiation Hardening: No; Package Quantity: 5000; Case/Package: SMD/SMT; Min Operating Temperature: -20°C; Packaging: Tape and Reel; Max Operating Temperature: 70°C
T1 T39 T40 = BSS84LT1G: P-CHANNEL MOSFET WITH DIODE; Part Description: 50V 130mA Single P-Channel Power MOSFET; Manufacturer: ON SEMICONDUCTOR; PressFit: No; Bonding: No; Part Number: BSS84LT1G; Component Kind: Standard; Component Type: Standard; Device: BSS84LT1G; PackageDescription: SOT23 3-Leads, Pitch 0.95mm - Body 1.4x3mm, IPC Medium Density; Manufacturer Part Number: BSS84LT1G; Pin Count: 3; Case: SOT23-3; Mounted: Yes; Socket: No; SMD: Yes; Sense: No; ComponentHeight: 1.1mm; HelpURL: \\cern.ch\dfs\Applications\Altium\Datasheets\BSS84LT1G.pdf; Author: CERN DEM JLC; CreateDate: 29.03.2012; LatestRevisionDate: 29.03.2012
TP53 TP54 = SMD_PAD_1.27X1.27MM: Part Description: 1.27mm x 1.27mm PCB Copper Area (SMD Test Point); Mounted: No; Part Number: SMD_PAD_1.27X1.27MM; Component Kind: Standard (No BOM); Component Type: Standard (No BOM); Pin Count: 1; Family: Test Point; Socket: No; SMD: Yes; Sense: No; Status: None; ComponentHeight: 0mm; HelpURL: Undefined; Author: CERN DEM JLC; CreateDate: 12.01.2008; LatestRevisionDate: 12.01.2008; PackageDescription: 1.27mm x 1.27mm PCB Copper Area (SMD Test Point)
X2 = X_CRYSTAL_HC49_SMT_27M: Crystal oscillator; Supplier 1: Newark; Supplier Part Number 1: 56P2844